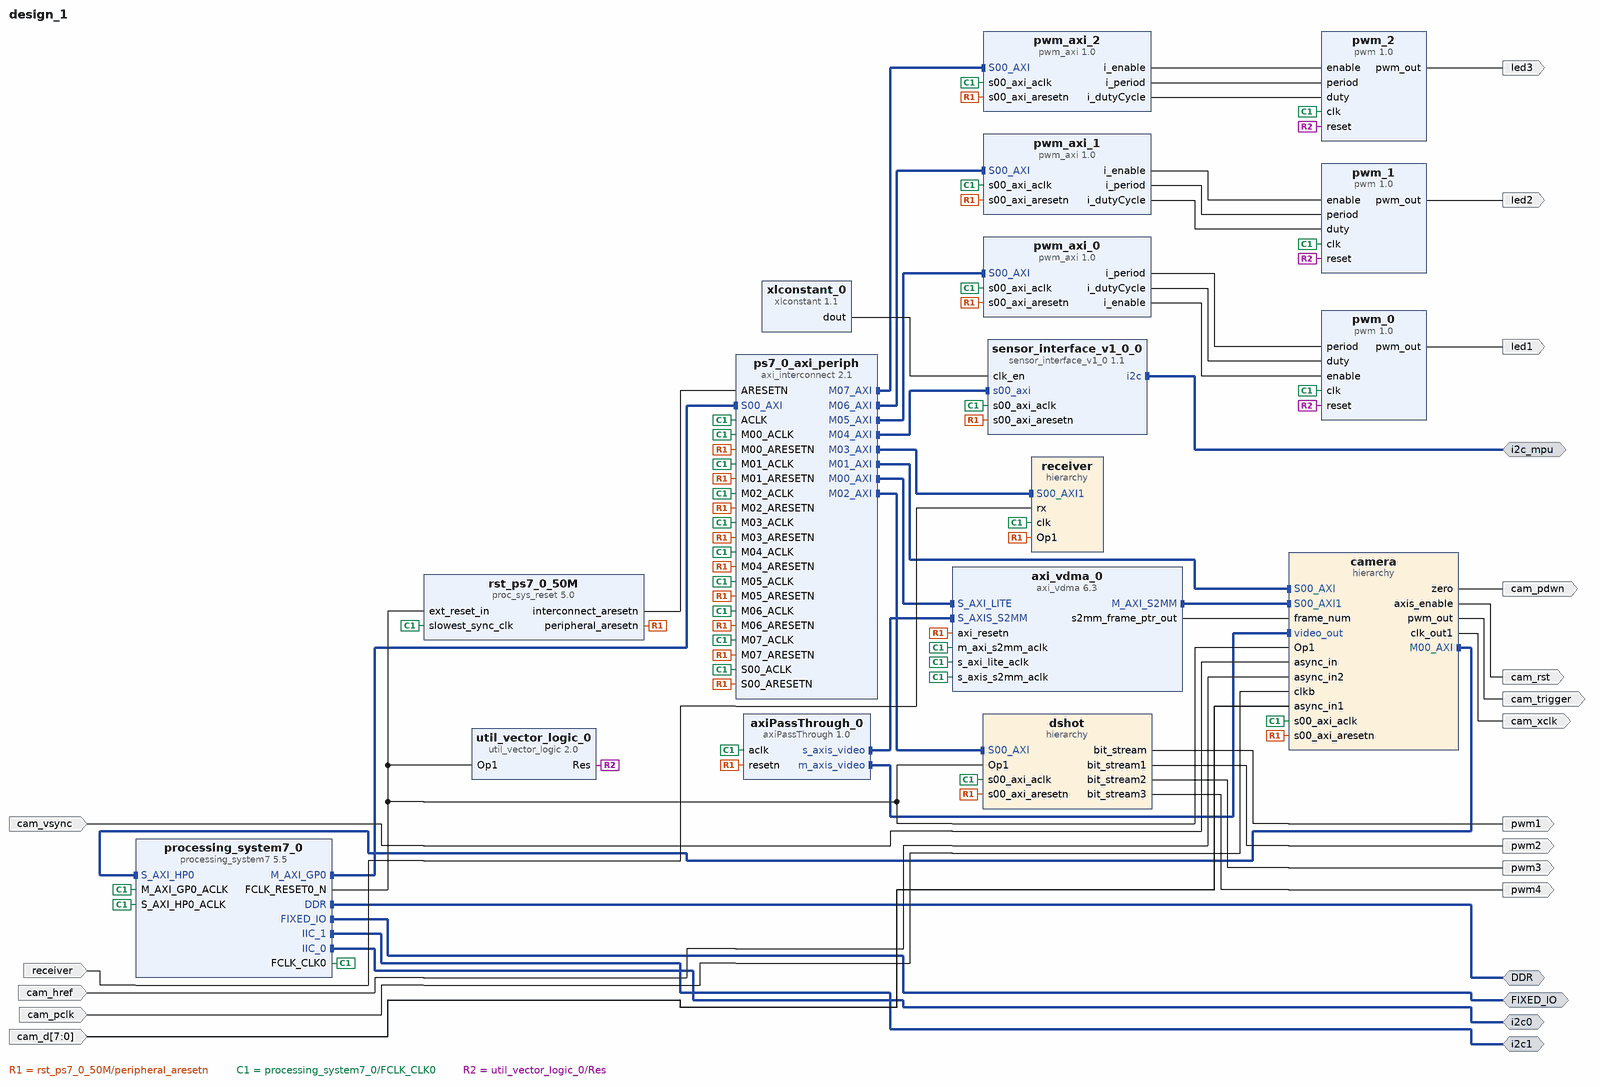
[diagram p0: block diagram of the top level]
# Vivado block design design_1, xc7z020clg400-3, Vivado 2018.2
create_bd_design design_1

create_bd_intf_port -mode Master -vlnv xilinx.com:interface:ddrx_rtl:1.0 DDR
create_bd_intf_port -mode Master -vlnv xilinx.com:display_processing_system7:fixedio_rtl:1.0 FIXED_IO
create_bd_intf_port -mode Master -vlnv xilinx.com:interface:iic_rtl:1.0 i2c1
create_bd_intf_port -mode Master -vlnv xilinx.com:interface:iic_rtl:1.0 i2c_mpu
create_bd_intf_port -mode Master -vlnv xilinx.com:interface:iic_rtl:1.0 i2c0
create_bd_port -dir O -type clk cam_xclk
create_bd_port -dir I cam_vsync
create_bd_port -dir O cam_rst
create_bd_port -dir O cam_pdwn
create_bd_port -dir I cam_href
create_bd_port -dir I -type clk cam_pclk
create_bd_port -dir I -from 7 -to 0 cam_d
create_bd_port -dir O cam_trigger
create_bd_port -dir O pwm1
create_bd_port -dir O pwm2
create_bd_port -dir O pwm3
create_bd_port -dir O pwm4
create_bd_port -dir O led1
create_bd_port -dir O led2
create_bd_port -dir O led3
create_bd_port -dir I receiver

create_bd_cell -type hier camera
create_bd_cell -type ip -vlnv xilinx.com:user:axiPassThrough:1.0 axiPassThrough_0
create_bd_cell -type hier dshot
create_bd_cell -type hier receiver
create_bd_cell -type ip -vlnv craftdrones:user:sensor_interface_v1_0:1.1 sensor_interface_v1_0_0
create_bd_cell -type ip -vlnv xilinx.com:ip:processing_system7:5.5 processing_system7_0
set_property -dict [list \
  CONFIG.PCW_UIPARAM_DDR_FREQ_MHZ 400 \
  CONFIG.PCW_CPU_CPU_6X4X_MAX_RANGE 867 \
  CONFIG.PCW_APU_PERIPHERAL_FREQMHZ 667 \
  CONFIG.PCW_SDIO_PERIPHERAL_FREQMHZ 100 \
  CONFIG.PCW_UART_PERIPHERAL_FREQMHZ 50 \
  CONFIG.PCW_I2C_PERIPHERAL_FREQMHZ 111.111115 \
  CONFIG.PCW_FPGA0_PERIPHERAL_FREQMHZ 50 \
  CONFIG.PCW_FPGA1_PERIPHERAL_FREQMHZ 10 \
  CONFIG.PCW_FPGA2_PERIPHERAL_FREQMHZ 10 \
  CONFIG.PCW_FPGA3_PERIPHERAL_FREQMHZ 10 \
  CONFIG.PCW_USE_S_AXI_HP0 1 \
  CONFIG.PCW_PERIPHERAL_BOARD_PRESET part0 \
  CONFIG.PCW_PRESET_BANK0_VOLTAGE {LVCMOS 1.8V} \
  CONFIG.PCW_PRESET_BANK1_VOLTAGE {LVCMOS 1.8V} \
  CONFIG.PCW_UIPARAM_DDR_MEMORY_TYPE {LPDDR 2} \
  CONFIG.PCW_UIPARAM_DDR_PARTNO Custom \
  CONFIG.PCW_QSPI_PERIPHERAL_ENABLE 1 \
  CONFIG.PCW_QSPI_QSPI_IO {MIO 1 .. 6} \
  CONFIG.PCW_QSPI_GRP_SINGLE_SS_ENABLE 1 \
  CONFIG.PCW_QSPI_GRP_SINGLE_SS_IO {MIO 1 .. 6} \
  CONFIG.PCW_SINGLE_QSPI_DATA_MODE x4 \
  CONFIG.PCW_QSPI_GRP_FBCLK_ENABLE 1 \
  CONFIG.PCW_QSPI_GRP_FBCLK_IO {MIO 8} \
  CONFIG.PCW_ENET0_PERIPHERAL_ENABLE 0 \
  CONFIG.PCW_SD0_PERIPHERAL_ENABLE 1 \
  CONFIG.PCW_SD0_SD0_IO {MIO 40 .. 45} \
  CONFIG.PCW_SD0_GRP_CD_ENABLE 0 \
  CONFIG.PCW_SD0_GRP_WP_ENABLE 0 \
  CONFIG.PCW_SD1_PERIPHERAL_ENABLE 1 \
  CONFIG.PCW_SD1_SD1_IO {MIO 10 .. 15} \
  CONFIG.PCW_UART0_PERIPHERAL_ENABLE 1 \
  CONFIG.PCW_UART0_UART0_IO {MIO 50 .. 51} \
  CONFIG.PCW_UART1_PERIPHERAL_ENABLE 0 \
  CONFIG.PCW_SPI1_PERIPHERAL_ENABLE 1 \
  CONFIG.PCW_SPI1_SPI1_IO {MIO 46 .. 51} \
  CONFIG.PCW_USB0_PERIPHERAL_ENABLE 0 \
  CONFIG.PCW_USB_RESET_ENABLE 1 \
  CONFIG.PCW_I2C0_PERIPHERAL_ENABLE 1 \
  CONFIG.PCW_I2C0_I2C0_IO EMIO \
  CONFIG.PCW_I2C1_PERIPHERAL_ENABLE 1 \
  CONFIG.PCW_I2C1_I2C1_IO EMIO \
  CONFIG.PCW_I2C_RESET_ENABLE 1 \
  CONFIG.PCW_I2C_RESET_SELECT {Share reset pin} \
  CONFIG.PCW_GPIO_PERIPHERAL_ENABLE 1 \
  CONFIG.PCW_GPIO_MIO_GPIO_ENABLE 1 \
  CONFIG.PCW_GPIO_MIO_GPIO_IO MIO \
  CONFIG.PCW_GPIO_EMIO_GPIO_ENABLE 1 \
  CONFIG.PCW_GPIO_EMIO_GPIO_IO 64 \
] [get_bd_cells processing_system7_0]
# 511 more settings of processing_system7_0 are not shown: defaults, MIO pin electricals, DDR timing, and values the tool derives
create_bd_cell -type ip -vlnv xilinx.com:ip:axi_interconnect:2.1 ps7_0_axi_periph
set_property -dict {CONFIG.NUM_MI 8 CONFIG.SYNCHRONIZATION_STAGES 2} [get_bd_cells ps7_0_axi_periph]
create_bd_cell -type ip -vlnv xilinx.com:ip:proc_sys_reset:5.0 rst_ps7_0_50M
create_bd_cell -type ip -vlnv xilinx.com:ip:xlconstant:1.1 xlconstant_0
create_bd_cell -type ip -vlnv xilinx.com:ip:axi_vdma:6.3 axi_vdma_0
set_property -dict [list \
  CONFIG.c_use_s2mm_fsync 2 \
  CONFIG.c_s2mm_genlock_mode 0 \
  CONFIG.c_s2mm_linebuffer_depth 2048 \
  CONFIG.c_include_mm2s 0 \
  CONFIG.c_s2mm_max_burst_length 64 \
] [get_bd_cells axi_vdma_0]
create_bd_cell -type ip -vlnv rit.edu:user:pwm_axi:1.0 pwm_axi_0
create_bd_cell -type ip -vlnv rit.edu:user:pwm_axi:1.0 pwm_axi_1
create_bd_cell -type ip -vlnv rit.edu:user:pwm_axi:1.0 pwm_axi_2
create_bd_cell -type ip -vlnv xilinx.com:user:pwm:1.0 pwm_0
create_bd_cell -type ip -vlnv xilinx.com:user:pwm:1.0 pwm_1
create_bd_cell -type ip -vlnv xilinx.com:user:pwm:1.0 pwm_2
create_bd_cell -type ip -vlnv xilinx.com:ip:util_vector_logic:2.0 util_vector_logic_0
set_property -dict {CONFIG.C_OPERATION not} [get_bd_cells util_vector_logic_0]

# ---- hierarchy /camera ----
current_bd_instance /camera
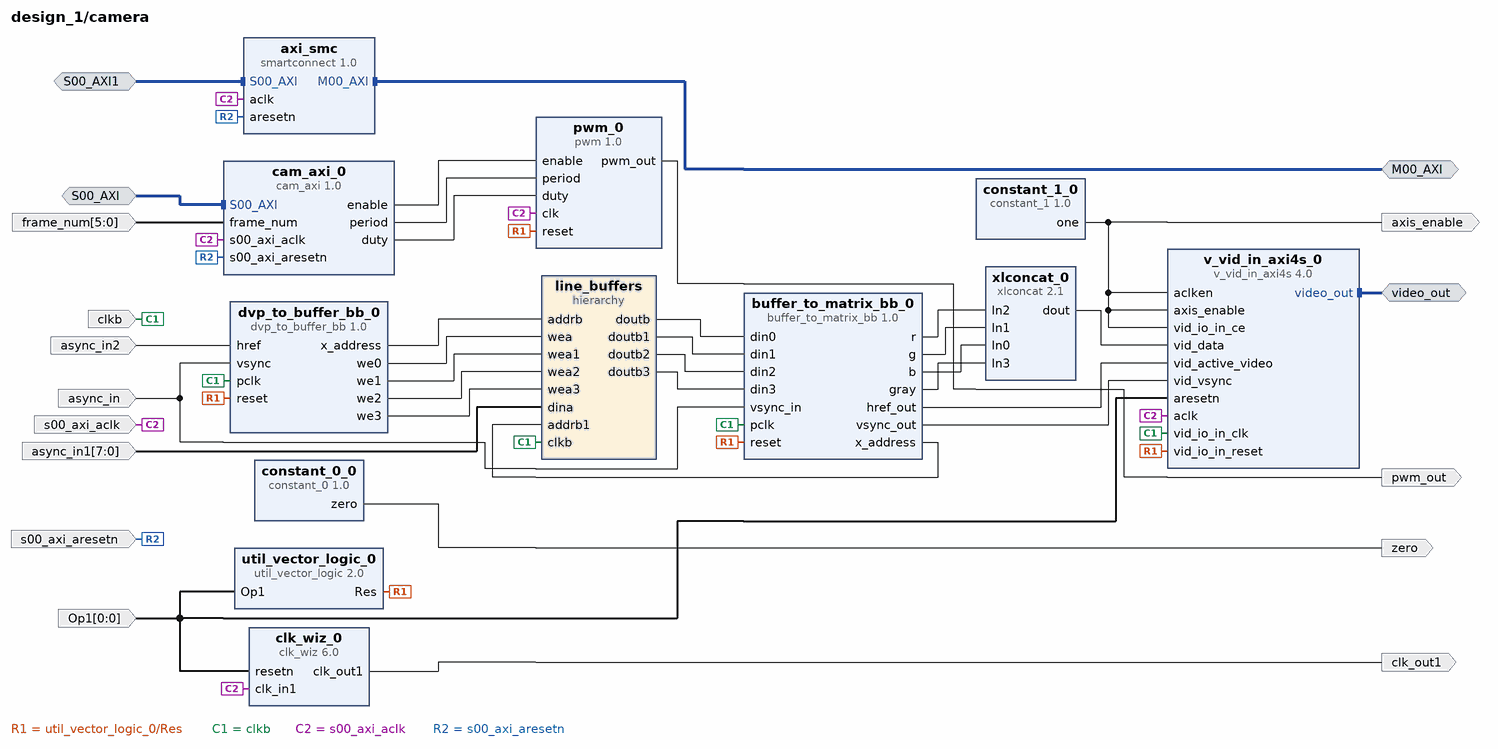
[diagram p1: block diagram inside /camera]
create_bd_intf_pin -mode Master -vlnv xilinx.com:interface:aximm_rtl:1.0 M00_AXI
create_bd_intf_pin -mode Slave -vlnv xilinx.com:interface:aximm_rtl:1.0 S00_AXI
create_bd_intf_pin -mode Master -vlnv xilinx.com:interface:axis_rtl:1.0 video_out
create_bd_intf_pin -mode Slave -vlnv xilinx.com:interface:aximm_rtl:1.0 S00_AXI1
create_bd_pin -dir I -type clk clkb
create_bd_pin -dir I async_in
create_bd_pin -dir I -type clk s00_axi_aclk
create_bd_pin -dir I -type rst s00_axi_aresetn
create_bd_pin -dir O axis_enable
create_bd_pin -dir I -from 0 -to 0 Op1
create_bd_pin -dir O pwm_out
create_bd_pin -dir O zero
create_bd_pin -dir I -from 7 -to 0 async_in1
create_bd_pin -dir O -type clk clk_out1
create_bd_pin -dir I async_in2
create_bd_pin -dir I -from 5 -to 0 frame_num

create_bd_cell -type ip -vlnv xilinx.com:user:cam_axi:1.0 cam_axi_0
create_bd_cell -type ip -vlnv xilinx.com:ip:xlconcat:2.1 xlconcat_0
set_property -dict [list \
  CONFIG.NUM_PORTS 4 \
  CONFIG.IN0_WIDTH 8 \
  CONFIG.IN1_WIDTH 8 \
  CONFIG.IN2_WIDTH 8 \
  CONFIG.IN3_WIDTH 8 \
] [get_bd_cells xlconcat_0]
create_bd_cell -type ip -vlnv craftdrones.com:user:constant_1:1.0 constant_1_0
create_bd_cell -type ip -vlnv xilinx.com:user:pwm:1.0 pwm_0
create_bd_cell -type ip -vlnv craftdrones.com:user:constant_0:1.0 constant_0_0
create_bd_cell -type ip -vlnv xilinx.com:ip:util_vector_logic:2.0 util_vector_logic_0
set_property -dict {CONFIG.C_SIZE 1 CONFIG.C_OPERATION not} [get_bd_cells util_vector_logic_0]
create_bd_cell -type hier line_buffers
create_bd_cell -type ip -vlnv xilinx.com:ip:smartconnect:1.0 axi_smc
set_property -dict {CONFIG.NUM_SI 1} [get_bd_cells axi_smc]
create_bd_cell -type ip -vlnv xilinx.com:ip:clk_wiz:6.0 clk_wiz_0
set_property -dict [list \
  CONFIG.CLKIN1_JITTER_PS 200.0 \
  CONFIG.CLKOUT1_REQUESTED_OUT_FREQ 24 \
  CONFIG.USE_LOCKED false \
  CONFIG.RESET_PORT resetn \
  CONFIG.MMCM_DIVCLK_DIVIDE 1 \
  CONFIG.MMCM_CLKFBOUT_MULT_F 19.500 \
  CONFIG.MMCM_CLKIN1_PERIOD 20.000 \
  CONFIG.MMCM_CLKIN2_PERIOD 10.0 \
  CONFIG.MMCM_CLKOUT0_DIVIDE_F 40.625 \
  CONFIG.RESET_TYPE ACTIVE_LOW \
  CONFIG.CLKOUT1_JITTER 239.726 \
  CONFIG.CLKOUT1_PHASE_ERROR 160.484 \
] [get_bd_cells clk_wiz_0]
create_bd_cell -type ip -vlnv xilinx.com:ip:v_vid_in_axi4s:4.0 v_vid_in_axi4s_0
set_property -dict [list \
  CONFIG.C_M_AXIS_VIDEO_FORMAT 6 \
  CONFIG.C_M_AXIS_VIDEO_DATA_WIDTH 8 \
  CONFIG.C_NATIVE_COMPONENT_WIDTH 8 \
  CONFIG.C_HAS_ASYNC_CLK 1 \
  CONFIG.C_ADDR_WIDTH 12 \
] [get_bd_cells v_vid_in_axi4s_0]
create_bd_cell -type ip -vlnv xilinx.com:user:dvp_to_buffer_bb:1.0 dvp_to_buffer_bb_0
create_bd_cell -type ip -vlnv xilinx.com:user:buffer_to_matrix_bb:1.0 buffer_to_matrix_bb_0

# ---- hierarchy /camera/line_buffers ----
current_bd_instance /camera/line_buffers
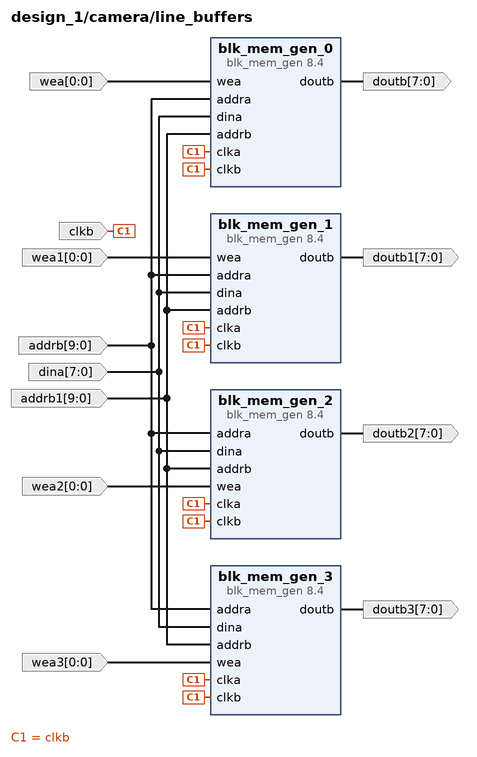
[diagram p2: block diagram inside /camera/line_buffers]
create_bd_pin -dir I -type clk clkb
create_bd_pin -dir I -from 0 -to 0 wea
create_bd_pin -dir I -from 9 -to 0 addrb
create_bd_pin -dir I -from 7 -to 0 dina
create_bd_pin -dir I -from 0 -to 0 wea1
create_bd_pin -dir I -from 0 -to 0 wea2
create_bd_pin -dir I -from 0 -to 0 wea3
create_bd_pin -dir O -from 7 -to 0 doutb
create_bd_pin -dir O -from 7 -to 0 doutb1
create_bd_pin -dir O -from 7 -to 0 doutb2
create_bd_pin -dir O -from 7 -to 0 doutb3
create_bd_pin -dir I -from 9 -to 0 addrb1

create_bd_cell -type ip -vlnv xilinx.com:ip:blk_mem_gen:8.4 blk_mem_gen_0
set_property -dict [list \
  CONFIG.Memory_Type Simple_Dual_Port_RAM \
  CONFIG.Enable_32bit_Address false \
  CONFIG.Use_Byte_Write_Enable false \
  CONFIG.Write_Width_A 8 \
  CONFIG.Write_Depth_A 572 \
  CONFIG.Operating_Mode_A NO_CHANGE \
  CONFIG.Enable_A Always_Enabled \
  CONFIG.Write_Width_B 8 \
  CONFIG.Read_Width_B 8 \
  CONFIG.Enable_B Always_Enabled \
  CONFIG.Register_PortB_Output_of_Memory_Primitives false \
  CONFIG.Port_B_Clock 100 \
  CONFIG.Port_B_Enable_Rate 100 \
  CONFIG.use_bram_block Stand_Alone \
] [get_bd_cells blk_mem_gen_0]
create_bd_cell -type ip -vlnv xilinx.com:ip:blk_mem_gen:8.4 blk_mem_gen_1
set_property -dict [list \
  CONFIG.Memory_Type Simple_Dual_Port_RAM \
  CONFIG.Enable_32bit_Address false \
  CONFIG.Use_Byte_Write_Enable false \
  CONFIG.Write_Width_A 8 \
  CONFIG.Write_Depth_A 572 \
  CONFIG.Operating_Mode_A NO_CHANGE \
  CONFIG.Enable_A Always_Enabled \
  CONFIG.Write_Width_B 8 \
  CONFIG.Read_Width_B 8 \
  CONFIG.Enable_B Always_Enabled \
  CONFIG.Register_PortB_Output_of_Memory_Primitives false \
  CONFIG.Port_B_Clock 100 \
  CONFIG.Port_B_Enable_Rate 100 \
  CONFIG.use_bram_block Stand_Alone \
] [get_bd_cells blk_mem_gen_1]
create_bd_cell -type ip -vlnv xilinx.com:ip:blk_mem_gen:8.4 blk_mem_gen_2
set_property -dict [list \
  CONFIG.Memory_Type Simple_Dual_Port_RAM \
  CONFIG.Enable_32bit_Address false \
  CONFIG.Use_Byte_Write_Enable false \
  CONFIG.Write_Width_A 8 \
  CONFIG.Write_Depth_A 572 \
  CONFIG.Operating_Mode_A NO_CHANGE \
  CONFIG.Enable_A Always_Enabled \
  CONFIG.Write_Width_B 8 \
  CONFIG.Read_Width_B 8 \
  CONFIG.Enable_B Always_Enabled \
  CONFIG.Register_PortB_Output_of_Memory_Primitives false \
  CONFIG.Port_B_Clock 100 \
  CONFIG.Port_B_Enable_Rate 100 \
  CONFIG.use_bram_block Stand_Alone \
] [get_bd_cells blk_mem_gen_2]
create_bd_cell -type ip -vlnv xilinx.com:ip:blk_mem_gen:8.4 blk_mem_gen_3
set_property -dict [list \
  CONFIG.Memory_Type Simple_Dual_Port_RAM \
  CONFIG.Enable_32bit_Address false \
  CONFIG.Use_Byte_Write_Enable false \
  CONFIG.Write_Width_A 8 \
  CONFIG.Write_Depth_A 572 \
  CONFIG.Operating_Mode_A NO_CHANGE \
  CONFIG.Enable_A Always_Enabled \
  CONFIG.Write_Width_B 8 \
  CONFIG.Read_Width_B 8 \
  CONFIG.Enable_B Always_Enabled \
  CONFIG.Register_PortB_Output_of_Memory_Primitives false \
  CONFIG.Port_B_Clock 100 \
  CONFIG.Port_B_Enable_Rate 100 \
  CONFIG.use_bram_block Stand_Alone \
] [get_bd_cells blk_mem_gen_3]

# ---- hierarchy /dshot ----
current_bd_instance /dshot
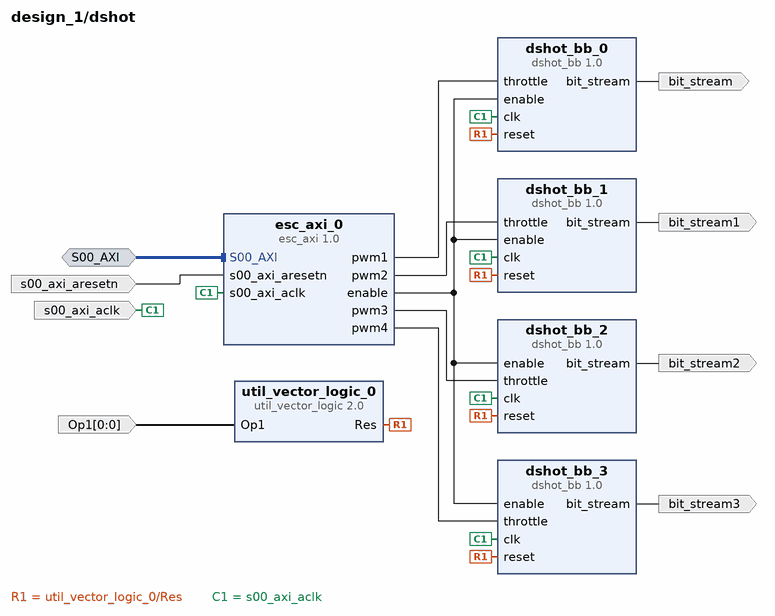
[diagram p3: block diagram inside /dshot]
create_bd_intf_pin -mode Slave -vlnv xilinx.com:interface:aximm_rtl:1.0 S00_AXI
create_bd_pin -dir I -type clk s00_axi_aclk
create_bd_pin -dir O bit_stream
create_bd_pin -dir O bit_stream1
create_bd_pin -dir O bit_stream2
create_bd_pin -dir I -type rst s00_axi_aresetn
create_bd_pin -dir O bit_stream3
create_bd_pin -dir I -from 0 -to 0 Op1

create_bd_cell -type ip -vlnv xilinx.com:ip:util_vector_logic:2.0 util_vector_logic_0
set_property -dict {CONFIG.C_SIZE 1 CONFIG.C_OPERATION not} [get_bd_cells util_vector_logic_0]
create_bd_cell -type ip -vlnv xilinx.com:user:esc_axi:1.0 esc_axi_0
create_bd_cell -type ip -vlnv xilinx.com:user:dshot_bb:1.0 dshot_bb_0
create_bd_cell -type ip -vlnv xilinx.com:user:dshot_bb:1.0 dshot_bb_1
create_bd_cell -type ip -vlnv xilinx.com:user:dshot_bb:1.0 dshot_bb_2
create_bd_cell -type ip -vlnv xilinx.com:user:dshot_bb:1.0 dshot_bb_3

# ---- hierarchy /receiver ----
current_bd_instance /receiver
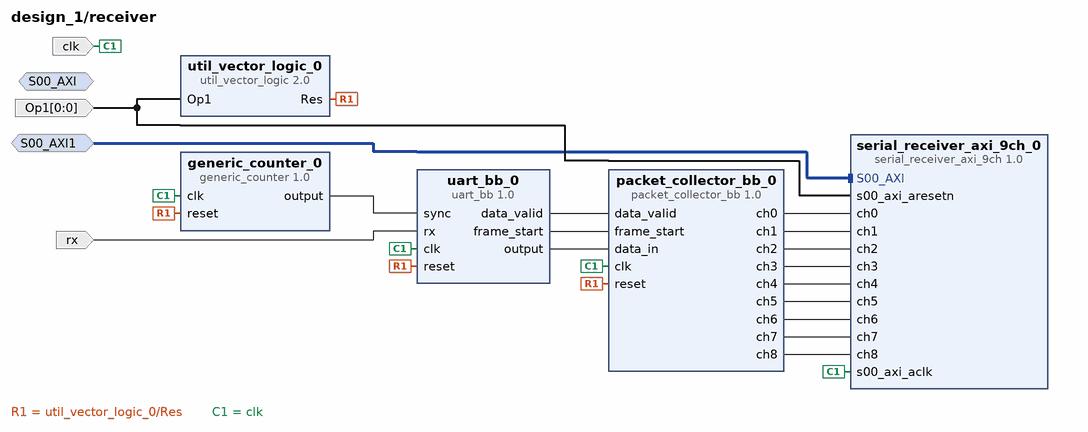
[diagram p4: block diagram inside /receiver]
create_bd_intf_pin -mode Slave -vlnv xilinx.com:interface:aximm_rtl:1.0 S00_AXI
create_bd_intf_pin -mode Slave -vlnv xilinx.com:interface:aximm_rtl:1.0 S00_AXI1
create_bd_pin -dir I -type clk clk
create_bd_pin -dir I rx
create_bd_pin -dir I -from 0 -to 0 Op1

create_bd_cell -type ip -vlnv xilinx.com:user:generic_counter:1.0 generic_counter_0
set_property -dict {CONFIG.max_count 26} [get_bd_cells generic_counter_0]
create_bd_cell -type ip -vlnv xilinx.com:ip:util_vector_logic:2.0 util_vector_logic_0
set_property -dict {CONFIG.C_SIZE 1 CONFIG.C_OPERATION not} [get_bd_cells util_vector_logic_0]
create_bd_cell -type ip -vlnv xilinx.com:user:serial_receiver_axi_9ch:1.0 serial_receiver_axi_9ch_0
create_bd_cell -type ip -vlnv xilinx.com:user:uart_bb:1.0 uart_bb_0
create_bd_cell -type ip -vlnv xilinx.com:user:packet_collector_bb:1.0 packet_collector_bb_0

# ---- connections ----

current_bd_instance /camera
connect_bd_intf_net [get_bd_intf_pins M00_AXI] [get_bd_intf_pins axi_smc/M00_AXI]
connect_bd_intf_net [get_bd_intf_pins S00_AXI] [get_bd_intf_pins cam_axi_0/S00_AXI]
connect_bd_intf_net [get_bd_intf_pins video_out] [get_bd_intf_pins v_vid_in_axi4s_0/video_out]
connect_bd_intf_net [get_bd_intf_pins S00_AXI1] [get_bd_intf_pins axi_smc/S00_AXI]
connect_bd_net [get_bd_pins util_vector_logic_0/Res] \
  [get_bd_pins pwm_0/reset] [get_bd_pins v_vid_in_axi4s_0/vid_io_in_reset] [get_bd_pins dvp_to_buffer_bb_0/reset] \
  [get_bd_pins buffer_to_matrix_bb_0/reset]
connect_bd_net [get_bd_pins cam_axi_0/enable] [get_bd_pins pwm_0/enable]
connect_bd_net [get_bd_pins cam_axi_0/period] [get_bd_pins pwm_0/period]
connect_bd_net [get_bd_pins cam_axi_0/duty] [get_bd_pins pwm_0/duty]
connect_bd_net [get_bd_pins xlconcat_0/dout] [get_bd_pins v_vid_in_axi4s_0/vid_data]
connect_bd_net [get_bd_pins line_buffers/doutb] [get_bd_pins buffer_to_matrix_bb_0/din0]
connect_bd_net [get_bd_pins line_buffers/doutb1] [get_bd_pins buffer_to_matrix_bb_0/din1]
connect_bd_net [get_bd_pins line_buffers/doutb2] [get_bd_pins buffer_to_matrix_bb_0/din2]
connect_bd_net [get_bd_pins line_buffers/doutb3] [get_bd_pins buffer_to_matrix_bb_0/din3]
connect_bd_net -net cam_pclk_1 [get_bd_pins clkb] \
  [get_bd_pins v_vid_in_axi4s_0/vid_io_in_clk] [get_bd_pins dvp_to_buffer_bb_0/pclk] [get_bd_pins buffer_to_matrix_bb_0/pclk] \
  [get_bd_pins line_buffers/clkb]
connect_bd_net -net cam_vsync_1 [get_bd_pins async_in] [get_bd_pins dvp_to_buffer_bb_0/vsync] [get_bd_pins buffer_to_matrix_bb_0/vsync_in]
connect_bd_net -net processing_system7_0_FCLK_CLK0 [get_bd_pins s00_axi_aclk] \
  [get_bd_pins cam_axi_0/s00_axi_aclk] [get_bd_pins pwm_0/clk] [get_bd_pins axi_smc/aclk] [get_bd_pins clk_wiz_0/clk_in1] \
  [get_bd_pins v_vid_in_axi4s_0/aclk]
connect_bd_net -net rst_ps7_0_50M_peripheral_aresetn [get_bd_pins s00_axi_aresetn] \
  [get_bd_pins cam_axi_0/s00_axi_aresetn] [get_bd_pins axi_smc/aresetn]
connect_bd_net [get_bd_pins constant_1_0/one] \
  [get_bd_pins axis_enable] [get_bd_pins v_vid_in_axi4s_0/vid_io_in_ce] [get_bd_pins v_vid_in_axi4s_0/aclken] \
  [get_bd_pins v_vid_in_axi4s_0/axis_enable]
connect_bd_net -net processing_system7_0_FCLK_RESET0_N [get_bd_pins Op1] \
  [get_bd_pins util_vector_logic_0/Op1] [get_bd_pins clk_wiz_0/resetn] [get_bd_pins v_vid_in_axi4s_0/aresetn]
connect_bd_net -net pwm_0_output [get_bd_pins pwm_0/pwm_out] [get_bd_pins pwm_out]
connect_bd_net [get_bd_pins constant_0_0/zero] [get_bd_pins zero]
connect_bd_net [get_bd_pins clk_wiz_0/clk_out1] [get_bd_pins clk_out1]
connect_bd_net -net cam_href_1 [get_bd_pins async_in2] [get_bd_pins dvp_to_buffer_bb_0/href]
connect_bd_net [get_bd_pins dvp_to_buffer_bb_0/x_address] [get_bd_pins line_buffers/addrb]
connect_bd_net [get_bd_pins dvp_to_buffer_bb_0/we0] [get_bd_pins line_buffers/wea]
connect_bd_net [get_bd_pins dvp_to_buffer_bb_0/we1] [get_bd_pins line_buffers/wea1]
connect_bd_net [get_bd_pins dvp_to_buffer_bb_0/we2] [get_bd_pins line_buffers/wea2]
connect_bd_net [get_bd_pins dvp_to_buffer_bb_0/we3] [get_bd_pins line_buffers/wea3]
connect_bd_net -net async_in1_1 [get_bd_pins async_in1] [get_bd_pins line_buffers/dina]
connect_bd_net [get_bd_pins frame_num] [get_bd_pins cam_axi_0/frame_num]
connect_bd_net [get_bd_pins buffer_to_matrix_bb_0/href_out] [get_bd_pins v_vid_in_axi4s_0/vid_active_video]
connect_bd_net [get_bd_pins buffer_to_matrix_bb_0/vsync_out] [get_bd_pins v_vid_in_axi4s_0/vid_vsync]
connect_bd_net [get_bd_pins buffer_to_matrix_bb_0/x_address] [get_bd_pins line_buffers/addrb1]
connect_bd_net [get_bd_pins buffer_to_matrix_bb_0/r] [get_bd_pins xlconcat_0/In2]
connect_bd_net [get_bd_pins buffer_to_matrix_bb_0/g] [get_bd_pins xlconcat_0/In1]
connect_bd_net [get_bd_pins buffer_to_matrix_bb_0/b] [get_bd_pins xlconcat_0/In0]
connect_bd_net [get_bd_pins buffer_to_matrix_bb_0/gray] [get_bd_pins xlconcat_0/In3]

current_bd_instance /camera/line_buffers
connect_bd_net -net cam_pclk_1 [get_bd_pins clkb] \
  [get_bd_pins blk_mem_gen_0/clka] [get_bd_pins blk_mem_gen_0/clkb] [get_bd_pins blk_mem_gen_1/clka] \
  [get_bd_pins blk_mem_gen_1/clkb] [get_bd_pins blk_mem_gen_2/clka] [get_bd_pins blk_mem_gen_2/clkb] \
  [get_bd_pins blk_mem_gen_3/clka] [get_bd_pins blk_mem_gen_3/clkb]
connect_bd_net -net dvp_to_buffer_0_we0 [get_bd_pins wea] [get_bd_pins blk_mem_gen_0/wea]
connect_bd_net -net dvp_to_buffer_0_address [get_bd_pins addrb] \
  [get_bd_pins blk_mem_gen_0/addra] [get_bd_pins blk_mem_gen_1/addra] [get_bd_pins blk_mem_gen_2/addra] \
  [get_bd_pins blk_mem_gen_3/addra]
connect_bd_net -net dvp_to_buffer_0_dout [get_bd_pins dina] \
  [get_bd_pins blk_mem_gen_0/dina] [get_bd_pins blk_mem_gen_1/dina] [get_bd_pins blk_mem_gen_2/dina] \
  [get_bd_pins blk_mem_gen_3/dina]
connect_bd_net -net wea1_1 [get_bd_pins wea1] [get_bd_pins blk_mem_gen_1/wea]
connect_bd_net -net wea2_1 [get_bd_pins wea2] [get_bd_pins blk_mem_gen_2/wea]
connect_bd_net -net wea3_1 [get_bd_pins wea3] [get_bd_pins blk_mem_gen_3/wea]
connect_bd_net [get_bd_pins blk_mem_gen_0/doutb] [get_bd_pins doutb]
connect_bd_net [get_bd_pins blk_mem_gen_1/doutb] [get_bd_pins doutb1]
connect_bd_net [get_bd_pins blk_mem_gen_2/doutb] [get_bd_pins doutb2]
connect_bd_net [get_bd_pins blk_mem_gen_3/doutb] [get_bd_pins doutb3]
connect_bd_net -net addrb1_1 [get_bd_pins addrb1] \
  [get_bd_pins blk_mem_gen_0/addrb] [get_bd_pins blk_mem_gen_1/addrb] [get_bd_pins blk_mem_gen_2/addrb] \
  [get_bd_pins blk_mem_gen_3/addrb]

current_bd_instance /dshot
connect_bd_intf_net [get_bd_intf_pins S00_AXI] [get_bd_intf_pins esc_axi_0/S00_AXI]
connect_bd_net [get_bd_pins util_vector_logic_0/Res] \
  [get_bd_pins dshot_bb_0/reset] [get_bd_pins dshot_bb_1/reset] [get_bd_pins dshot_bb_2/reset] [get_bd_pins dshot_bb_3/reset]
connect_bd_net [get_bd_pins esc_axi_0/enable] \
  [get_bd_pins dshot_bb_0/enable] [get_bd_pins dshot_bb_1/enable] [get_bd_pins dshot_bb_2/enable] \
  [get_bd_pins dshot_bb_3/enable]
connect_bd_net [get_bd_pins esc_axi_0/pwm1] [get_bd_pins dshot_bb_0/throttle]
connect_bd_net -net processing_system7_0_FCLK_CLK0 [get_bd_pins s00_axi_aclk] \
  [get_bd_pins esc_axi_0/s00_axi_aclk] [get_bd_pins dshot_bb_0/clk] [get_bd_pins dshot_bb_1/clk] [get_bd_pins dshot_bb_2/clk] \
  [get_bd_pins dshot_bb_3/clk]
connect_bd_net -net rst_ps7_0_50M_peripheral_aresetn [get_bd_pins s00_axi_aresetn] [get_bd_pins esc_axi_0/s00_axi_aresetn]
connect_bd_net -net Op1_1 [get_bd_pins Op1] [get_bd_pins util_vector_logic_0/Op1]
connect_bd_net [get_bd_pins dshot_bb_0/bit_stream] [get_bd_pins bit_stream]
connect_bd_net [get_bd_pins dshot_bb_1/bit_stream] [get_bd_pins bit_stream1]
connect_bd_net [get_bd_pins dshot_bb_2/bit_stream] [get_bd_pins bit_stream2]
connect_bd_net [get_bd_pins dshot_bb_3/bit_stream] [get_bd_pins bit_stream3]
connect_bd_net [get_bd_pins esc_axi_0/pwm2] [get_bd_pins dshot_bb_1/throttle]
connect_bd_net [get_bd_pins esc_axi_0/pwm3] [get_bd_pins dshot_bb_2/throttle]
connect_bd_net [get_bd_pins esc_axi_0/pwm4] [get_bd_pins dshot_bb_3/throttle]

current_bd_instance /receiver
connect_bd_intf_net [get_bd_intf_pins S00_AXI1] [get_bd_intf_pins serial_receiver_axi_9ch_0/S00_AXI]
connect_bd_net [get_bd_pins util_vector_logic_0/Res] \
  [get_bd_pins generic_counter_0/reset] [get_bd_pins uart_bb_0/reset] [get_bd_pins packet_collector_bb_0/reset]
connect_bd_net [get_bd_pins generic_counter_0/output] [get_bd_pins uart_bb_0/sync]
connect_bd_net -net processing_system7_0_FCLK_CLK0 [get_bd_pins clk] \
  [get_bd_pins generic_counter_0/clk] [get_bd_pins serial_receiver_axi_9ch_0/s00_axi_aclk] [get_bd_pins uart_bb_0/clk] \
  [get_bd_pins packet_collector_bb_0/clk]
connect_bd_net -net receiver_1 [get_bd_pins rx] [get_bd_pins uart_bb_0/rx]
connect_bd_net -net rst_ps7_0_50M_peripheral_aresetn [get_bd_pins Op1] \
  [get_bd_pins util_vector_logic_0/Op1] [get_bd_pins serial_receiver_axi_9ch_0/s00_axi_aresetn]
connect_bd_net [get_bd_pins uart_bb_0/data_valid] [get_bd_pins packet_collector_bb_0/data_valid]
connect_bd_net [get_bd_pins uart_bb_0/frame_start] [get_bd_pins packet_collector_bb_0/frame_start]
connect_bd_net [get_bd_pins uart_bb_0/output] [get_bd_pins packet_collector_bb_0/data_in]
connect_bd_net [get_bd_pins packet_collector_bb_0/ch0] [get_bd_pins serial_receiver_axi_9ch_0/ch0]
connect_bd_net [get_bd_pins packet_collector_bb_0/ch1] [get_bd_pins serial_receiver_axi_9ch_0/ch1]
connect_bd_net [get_bd_pins packet_collector_bb_0/ch2] [get_bd_pins serial_receiver_axi_9ch_0/ch2]
connect_bd_net [get_bd_pins packet_collector_bb_0/ch3] [get_bd_pins serial_receiver_axi_9ch_0/ch3]
connect_bd_net [get_bd_pins packet_collector_bb_0/ch4] [get_bd_pins serial_receiver_axi_9ch_0/ch4]
connect_bd_net [get_bd_pins packet_collector_bb_0/ch5] [get_bd_pins serial_receiver_axi_9ch_0/ch5]
connect_bd_net [get_bd_pins packet_collector_bb_0/ch6] [get_bd_pins serial_receiver_axi_9ch_0/ch6]
connect_bd_net [get_bd_pins packet_collector_bb_0/ch7] [get_bd_pins serial_receiver_axi_9ch_0/ch7]
connect_bd_net [get_bd_pins packet_collector_bb_0/ch8] [get_bd_pins serial_receiver_axi_9ch_0/ch8]

current_bd_instance /
connect_bd_intf_net -intf_net axi_smc_M00_AXI [get_bd_intf_pins camera/M00_AXI] [get_bd_intf_pins processing_system7_0/S_AXI_HP0]
connect_bd_intf_net [get_bd_intf_pins processing_system7_0/M_AXI_GP0] [get_bd_intf_pins ps7_0_axi_periph/S00_AXI]
connect_bd_intf_net [get_bd_intf_pins ps7_0_axi_periph/M01_AXI] [get_bd_intf_pins camera/S00_AXI]
connect_bd_intf_net [get_bd_intf_pins axiPassThrough_0/m_axis_video] [get_bd_intf_pins camera/video_out]
connect_bd_intf_net [get_bd_intf_pins ps7_0_axi_periph/M02_AXI] [get_bd_intf_pins dshot/S00_AXI]
connect_bd_intf_net [get_bd_intf_pins ps7_0_axi_periph/M03_AXI] [get_bd_intf_pins receiver/S00_AXI1]
connect_bd_intf_net [get_bd_intf_pins ps7_0_axi_periph/M04_AXI] [get_bd_intf_pins sensor_interface_v1_0_0/s00_axi]
connect_bd_intf_net [get_bd_intf_pins axiPassThrough_0/s_axis_video] [get_bd_intf_pins axi_vdma_0/S_AXIS_S2MM]
connect_bd_intf_net [get_bd_intf_pins ps7_0_axi_periph/M00_AXI] [get_bd_intf_pins axi_vdma_0/S_AXI_LITE]
connect_bd_intf_net [get_bd_intf_pins axi_vdma_0/M_AXI_S2MM] [get_bd_intf_pins camera/S00_AXI1]
connect_bd_intf_net [get_bd_intf_pins ps7_0_axi_periph/M05_AXI] [get_bd_intf_pins pwm_axi_0/S00_AXI]
connect_bd_intf_net [get_bd_intf_pins ps7_0_axi_periph/M06_AXI] [get_bd_intf_pins pwm_axi_1/S00_AXI]
connect_bd_intf_net [get_bd_intf_pins ps7_0_axi_periph/M07_AXI] [get_bd_intf_pins pwm_axi_2/S00_AXI]
connect_bd_intf_net [get_bd_intf_ports DDR] [get_bd_intf_pins processing_system7_0/DDR]
connect_bd_intf_net [get_bd_intf_ports FIXED_IO] [get_bd_intf_pins processing_system7_0/FIXED_IO]
connect_bd_intf_net [get_bd_intf_ports i2c1] [get_bd_intf_pins processing_system7_0/IIC_1]
connect_bd_intf_net [get_bd_intf_ports i2c_mpu] [get_bd_intf_pins sensor_interface_v1_0_0/i2c]
connect_bd_intf_net [get_bd_intf_ports i2c0] [get_bd_intf_pins processing_system7_0/IIC_0]
connect_bd_net [get_bd_pins rst_ps7_0_50M/peripheral_aresetn] \
  [get_bd_pins axiPassThrough_0/resetn] [get_bd_pins sensor_interface_v1_0_0/s00_axi_aresetn] \
  [get_bd_pins axi_vdma_0/axi_resetn] [get_bd_pins camera/s00_axi_aresetn] [get_bd_pins dshot/s00_axi_aresetn] \
  [get_bd_pins receiver/Op1] [get_bd_pins ps7_0_axi_periph/S00_ARESETN] [get_bd_pins ps7_0_axi_periph/M00_ARESETN] \
  [get_bd_pins ps7_0_axi_periph/M01_ARESETN] [get_bd_pins ps7_0_axi_periph/M02_ARESETN] \
  [get_bd_pins ps7_0_axi_periph/M03_ARESETN] [get_bd_pins ps7_0_axi_periph/M04_ARESETN] \
  [get_bd_pins pwm_axi_0/s00_axi_aresetn] [get_bd_pins ps7_0_axi_periph/M05_ARESETN] [get_bd_pins pwm_axi_1/s00_axi_aresetn] \
  [get_bd_pins ps7_0_axi_periph/M06_ARESETN] [get_bd_pins pwm_axi_2/s00_axi_aresetn] \
  [get_bd_pins ps7_0_axi_periph/M07_ARESETN]
connect_bd_net [get_bd_pins rst_ps7_0_50M/interconnect_aresetn] [get_bd_pins ps7_0_axi_periph/ARESETN]
connect_bd_net -net clk_wiz_0_clk_out1 [get_bd_pins camera/clk_out1] [get_bd_ports cam_xclk]
connect_bd_net [get_bd_ports cam_vsync] [get_bd_pins camera/async_in]
connect_bd_net -net constant_1_0_one [get_bd_pins camera/axis_enable] [get_bd_ports cam_rst]
connect_bd_net -net constant_0_0_zero [get_bd_pins camera/zero] [get_bd_ports cam_pdwn]
connect_bd_net [get_bd_ports cam_href] [get_bd_pins camera/async_in2]
connect_bd_net [get_bd_ports cam_pclk] [get_bd_pins camera/clkb]
connect_bd_net [get_bd_ports cam_d] [get_bd_pins camera/async_in1]
connect_bd_net -net pwm_0_output [get_bd_pins camera/pwm_out] [get_bd_ports cam_trigger]
connect_bd_net [get_bd_pins processing_system7_0/FCLK_RESET0_N] \
  [get_bd_pins rst_ps7_0_50M/ext_reset_in] [get_bd_pins camera/Op1] [get_bd_pins dshot/Op1] \
  [get_bd_pins util_vector_logic_0/Op1]
connect_bd_net [get_bd_pins processing_system7_0/FCLK_CLK0] \
  [get_bd_pins axiPassThrough_0/aclk] [get_bd_pins sensor_interface_v1_0_0/s00_axi_aclk] \
  [get_bd_pins processing_system7_0/M_AXI_GP0_ACLK] [get_bd_pins processing_system7_0/S_AXI_HP0_ACLK] \
  [get_bd_pins rst_ps7_0_50M/slowest_sync_clk] [get_bd_pins axi_vdma_0/m_axi_s2mm_aclk] \
  [get_bd_pins axi_vdma_0/s_axis_s2mm_aclk] [get_bd_pins axi_vdma_0/s_axi_lite_aclk] [get_bd_pins camera/s00_axi_aclk] \
  [get_bd_pins dshot/s00_axi_aclk] [get_bd_pins receiver/clk] [get_bd_pins ps7_0_axi_periph/ACLK] \
  [get_bd_pins ps7_0_axi_periph/S00_ACLK] [get_bd_pins ps7_0_axi_periph/M00_ACLK] [get_bd_pins ps7_0_axi_periph/M01_ACLK] \
  [get_bd_pins ps7_0_axi_periph/M02_ACLK] [get_bd_pins ps7_0_axi_periph/M03_ACLK] [get_bd_pins ps7_0_axi_periph/M04_ACLK] \
  [get_bd_pins pwm_axi_0/s00_axi_aclk] [get_bd_pins ps7_0_axi_periph/M05_ACLK] [get_bd_pins pwm_axi_1/s00_axi_aclk] \
  [get_bd_pins ps7_0_axi_periph/M06_ACLK] [get_bd_pins pwm_axi_2/s00_axi_aclk] [get_bd_pins ps7_0_axi_periph/M07_ACLK] \
  [get_bd_pins pwm_0/clk] [get_bd_pins pwm_1/clk] [get_bd_pins pwm_2/clk]
connect_bd_net [get_bd_pins xlconstant_0/dout] [get_bd_pins sensor_interface_v1_0_0/clk_en]
connect_bd_net [get_bd_pins dshot/bit_stream] [get_bd_ports pwm1]
connect_bd_net [get_bd_pins dshot/bit_stream1] [get_bd_ports pwm2]
connect_bd_net [get_bd_pins dshot/bit_stream2] [get_bd_ports pwm3]
connect_bd_net [get_bd_pins dshot/bit_stream3] [get_bd_ports pwm4]
connect_bd_net [get_bd_ports receiver] [get_bd_pins receiver/rx]
connect_bd_net [get_bd_pins axi_vdma_0/s2mm_frame_ptr_out] [get_bd_pins camera/frame_num]
connect_bd_net [get_bd_pins pwm_0/pwm_out] [get_bd_ports led1]
connect_bd_net [get_bd_pins pwm_1/pwm_out] [get_bd_ports led2]
connect_bd_net [get_bd_pins pwm_2/pwm_out] [get_bd_ports led3]
connect_bd_net [get_bd_pins pwm_axi_0/i_period] [get_bd_pins pwm_0/period]
connect_bd_net [get_bd_pins pwm_axi_0/i_dutyCycle] [get_bd_pins pwm_0/duty]
connect_bd_net [get_bd_pins pwm_axi_0/i_enable] [get_bd_pins pwm_0/enable]
connect_bd_net [get_bd_pins pwm_axi_1/i_enable] [get_bd_pins pwm_1/enable]
connect_bd_net [get_bd_pins pwm_axi_1/i_period] [get_bd_pins pwm_1/period]
connect_bd_net [get_bd_pins pwm_axi_1/i_dutyCycle] [get_bd_pins pwm_1/duty]
connect_bd_net [get_bd_pins pwm_axi_2/i_enable] [get_bd_pins pwm_2/enable]
connect_bd_net [get_bd_pins pwm_axi_2/i_period] [get_bd_pins pwm_2/period]
connect_bd_net [get_bd_pins pwm_axi_2/i_dutyCycle] [get_bd_pins pwm_2/duty]
connect_bd_net [get_bd_pins util_vector_logic_0/Res] [get_bd_pins pwm_0/reset] [get_bd_pins pwm_1/reset] [get_bd_pins pwm_2/reset]

# ---- address map ----
assign_bd_address -offset 0x00000000 -range 1G -target_address_space [get_bd_addr_spaces axi_vdma_0/Data_S2MM] [get_bd_addr_segs processing_system7_0/S_AXI_HP0/HP0_DDR_LOWOCM]
assign_bd_address -offset 0x43000000 -range 64K -target_address_space [get_bd_addr_spaces processing_system7_0/Data] [get_bd_addr_segs axi_vdma_0/S_AXI_LITE/Reg]
assign_bd_address -offset 0x43C00000 -range 64K -target_address_space [get_bd_addr_spaces processing_system7_0/Data] [get_bd_addr_segs dshot/esc_axi_0/S00_AXI/S00_AXI_reg]
assign_bd_address -offset 0x43C10000 -range 64K -target_address_space [get_bd_addr_spaces processing_system7_0/Data] [get_bd_addr_segs receiver/serial_receiver_axi_9ch_0/S00_AXI/S00_AXI_reg]
assign_bd_address -offset 0x43C20000 -range 64K -target_address_space [get_bd_addr_spaces processing_system7_0/Data] [get_bd_addr_segs sensor_interface_v1_0_0/s00_axi/reg0]
assign_bd_address -offset 0x43C30000 -range 64K -target_address_space [get_bd_addr_spaces processing_system7_0/Data] [get_bd_addr_segs pwm_axi_0/S00_AXI/S00_AXI_reg]
assign_bd_address -offset 0x43C40000 -range 64K -target_address_space [get_bd_addr_spaces processing_system7_0/Data] [get_bd_addr_segs pwm_axi_1/S00_AXI/S00_AXI_reg]
assign_bd_address -offset 0x43C50000 -range 64K -target_address_space [get_bd_addr_spaces processing_system7_0/Data] [get_bd_addr_segs camera/cam_axi_0/S00_AXI/S00_AXI_reg]
assign_bd_address -offset 0x43C60000 -range 64K -target_address_space [get_bd_addr_spaces processing_system7_0/Data] [get_bd_addr_segs pwm_axi_2/S00_AXI/S00_AXI_reg]

validate_bd_design
save_bd_design
